# EAGLE design makerbot (EAGLE 8.2.0)
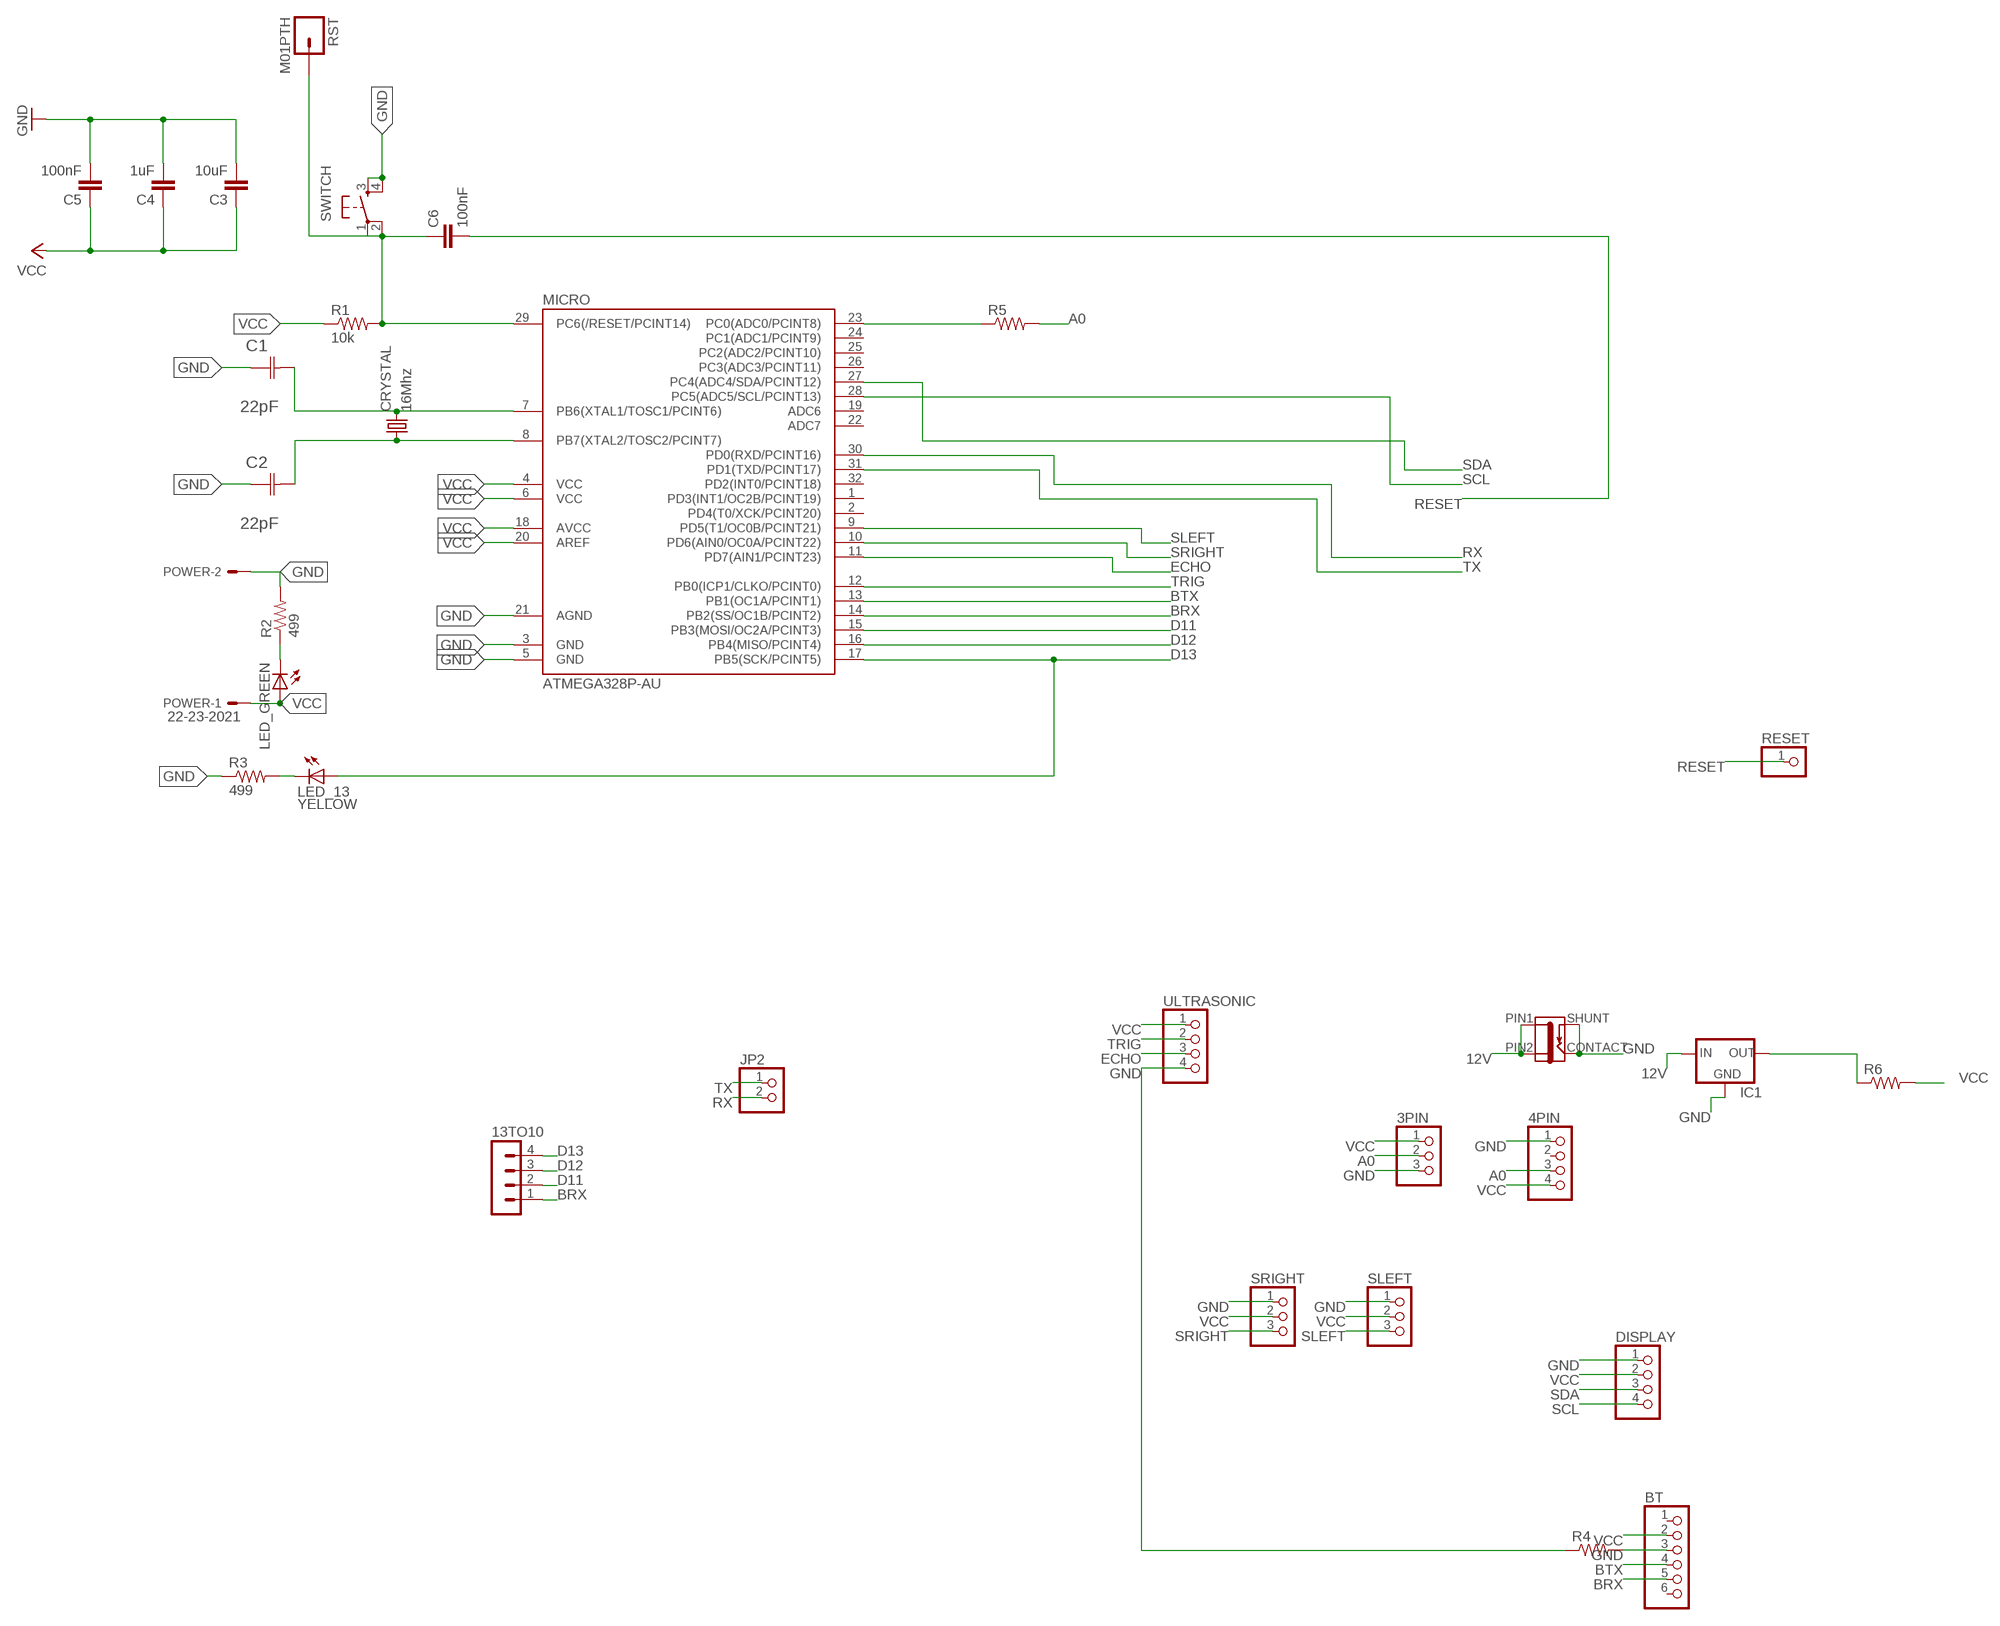
[diagram p0: schematic, sheet 1]

## Parts
3PIN  PINHD-1X3  [1X03]
4PIN  PINHD-1X4  [1X04]
13TO10  MA04-1  [MA04-1]
BT  PINHD-1X6  [1X06]
C1  22pF  0612ZC225MAT2A  [CAPC3216X178N]
C2  22pF  0612ZC225MAT2A  [CAPC3216X178N]
C3  10uF  CAP1206  [1206]
C4  1uF  CAP1206  [1206]
C5  100nF  CAP1206  [1206]
C6  100nF  CAP1206  [1206]
CRYSTAL  16Mhz  CSM-7X-DU  [CSM-7X-DU]
DISPLAY  PINHD-1X4  [1X04]
IC1  78XXL  [78XXL]
J1  JACK-2.1MM  [PJ-002AH-SMT]
JP2  PINHD-1X2  [1X02]
LED_13  YELLOW  LED1206  [1206]
LED_GREEN  LED1206  [1206]
MICRO  ATMEGA328P-AU  ATMEGA48/88/168-AU  [TQFP32-08]
POWER  22-23-2021  [22-23-2021]
R1  10k  RESISTOR1206  [1206]
R2  499  RESISTOR1206  [1206]
R3  499  RESISTOR1206  [1206]
R4  RES-US1206FAB  [R1206FAB]
R5  RES-US1206FAB  [R1206FAB]
R6  RES-US1206FAB  [R1206FAB]
RESET  PINHD-1X1  [1X01]
RST  M01PTH  [1X01]
SLEFT  PINHD-1X3  [1X03]
SRIGHT  PINHD-1X3  [1X03]
SWITCH  6MM_SWITCH6MM_SWITCH  [6MM_SWITCH]
ULTRASONIC  PINHD-1X4  [1X04]

## Nets
12V: IC1.IN J1.PIN1 J1.PIN2
A0: 3PIN.2 4PIN.3 MICRO.23(PC0(ADC0/PCINT8)) R5.1 R5.2
BRX: 13TO10.1 BT.5 MICRO.14(PB2(SS/OC1B/PCINT2))
BTX: BT.4 MICRO.13(PB1(OC1A/PCINT1))
D11: 13TO10.2 MICRO.15(PB3(MOSI/OC2A/PCINT3))
D12: 13TO10.3 MICRO.16(PB4(MISO/PCINT4))
D13: 13TO10.4 LED_13.1(A) MICRO.17(PB5(SCK/PCINT5))
ECHO: MICRO.11(PD7(AIN1/PCINT23)) ULTRASONIC.3
GND: 3PIN.3 4PIN.1 BT.3 C1.1(C1) C2.1(C1) C3.2 C4.2 C5.2 DISPLAY.1 IC1.GND J1.CONTACT J1.SHUNT MICRO.3(GND) MICRO.5(GND) MICRO.21(AGND) POWER.2 R2.2 R3.1 R4.1 R4.2 SLEFT.1 SRIGHT.1 SWITCH.3(S) SWITCH.4(S1) ULTRASONIC.4
N$2: C1.2(C2) CRYSTAL.2 MICRO.7(PB6(XTAL1/TOSC1/PCINT6))
N$9: C2.2(C2) CRYSTAL.1 MICRO.8(PB7(XTAL2/TOSC2/PCINT7))
N$26: LED_GREEN.2(C) R2.1
N$27: LED_13.2(C) R3.2
N$28: C6.1 MICRO.29(PC6(/RESET/PCINT14)) R1.2 RST.1 SWITCH.1(P) SWITCH.2(P1)
RESET: C6.2 RESET.1
RX: JP2.2 MICRO.30(PD0(RXD/PCINT16))
SCL: DISPLAY.4 MICRO.28(PC5(ADC5/SCL/PCINT13))
SDA: DISPLAY.3 MICRO.27(PC4(ADC4/SDA/PCINT12))
SLEFT: MICRO.9(PD5(T1/OC0B/PCINT21)) SLEFT.3
SRIGHT: MICRO.10(PD6(AIN0/OC0A/PCINT22)) SRIGHT.3
TRIG: MICRO.12(PB0(ICP1/CLKO/PCINT0)) ULTRASONIC.2
TX: JP2.1 MICRO.31(PD1(TXD/PCINT17))
VCC: 3PIN.1 4PIN.4 BT.2 C3.1 C4.1 C5.1 DISPLAY.2 IC1.OUT LED_GREEN.1(A) MICRO.4(VCC) MICRO.6(VCC) MICRO.18(AVCC) MICRO.20(AREF) POWER.1 R1.1 R6.1 R6.2 SLEFT.2 SRIGHT.2 ULTRASONIC.1
Unconnected: 4PIN.2 BT.1 BT.6 MICRO.1(PD3(INT1/OC2B/PCINT19)) MICRO.2(PD4(T0/XCK/PCINT20)) MICRO.19(ADC6) MICRO.22(ADC7) MICRO.24(PC1(ADC1/PCINT9)) MICRO.25(PC2(ADC2/PCINT10)) MICRO.26(PC3(ADC3/PCINT11)) MICRO.32(PD2(INT0/PCINT18))

## Library data of the parts
3PIN SLEFT SRIGHT = pinhead:PINHD-1X3: PIN HEADER
4PIN DISPLAY ULTRASONIC = pinhead:PINHD-1X4: PIN HEADER
13TO10 = con-lstb:MA04-1: PIN HEADER; OC_FARNELL: unknown; OC_NEWARK: unknown
BT = pinhead:PINHD-1X6: PIN HEADER
C1 C2 = AVX_By_element14_Batch_1:0612ZC225MAT2A: Capacitor 1206; MPN: 0612ZC225MAT2A; OC_FARNELL: -; OC_NEWARK: 12N3209; SUPPLIER: AVX; TOLERANCE: ±20%; VALUE: 2.2µF; VOLTAGERATING: 10V
C3-C6 = 01_SparkFun:CAP: Capacitor Standard 0603 ceramic capacitor, and 0.1" leaded capacitor.
CRYSTAL = 01_FAB_Hello:CSM-7X-DU: SMD CRYSTAL Source: www.ecsxtal.com .. Crystal 3.6864MHz CSM_7X_DU.PDF; OC_FARNELL: unknown; OC_NEWARK: unknown
IC1 = v-reg:78XXL: VOLTAGE REGULATOR
J1 = fab:JACK-2.1MM: SMD DC power jack PJ-002AH-SMT As found in the fablab inventory. Made by Zaerc.
JP2 = pinhead:PINHD-1X2: PIN HEADER
LED_13 LED_GREEN = 01_FAB_Hello:LED
MICRO = atmega8:ATMEGA48/88/168
POWER = con-molex:22-23-2021: .100" (2.54mm) Center Header - 2 Pin; MF: MOLEX; MPN: 22-23-2021; OC_FARNELL: 1462926; OC_NEWARK: 25C3832
R1-R3 = 01_SparkFun:RESISTOR: Resistor Basic schematic elements and footprints for 0603, 1206, and PTH 1/10th watt (small) resistors.
R4-R6 = fab:RES-US: Resistor (US Symbol) Variants with postfix FAB are widened to allow the routing of internal traces
RESET = pinhead:PINHD-1X1: PIN HEADER
RST = 01_SparkFun:M01: Header 1 Standard 1-pin 0.1" header. Use with straight break away headers (SKU : PRT-00116), right angle break away headers (PRT-00553), swiss pins (PRT-00743), machine pins (PRT-00117), and female headers (PRT-00115).
SWITCH = 01_FAB_Hello:6MM_SWITCH: OMRON SWITCH

## Net classes
0 default: width 0.1 mm, clearance 0.5 mm

## Board
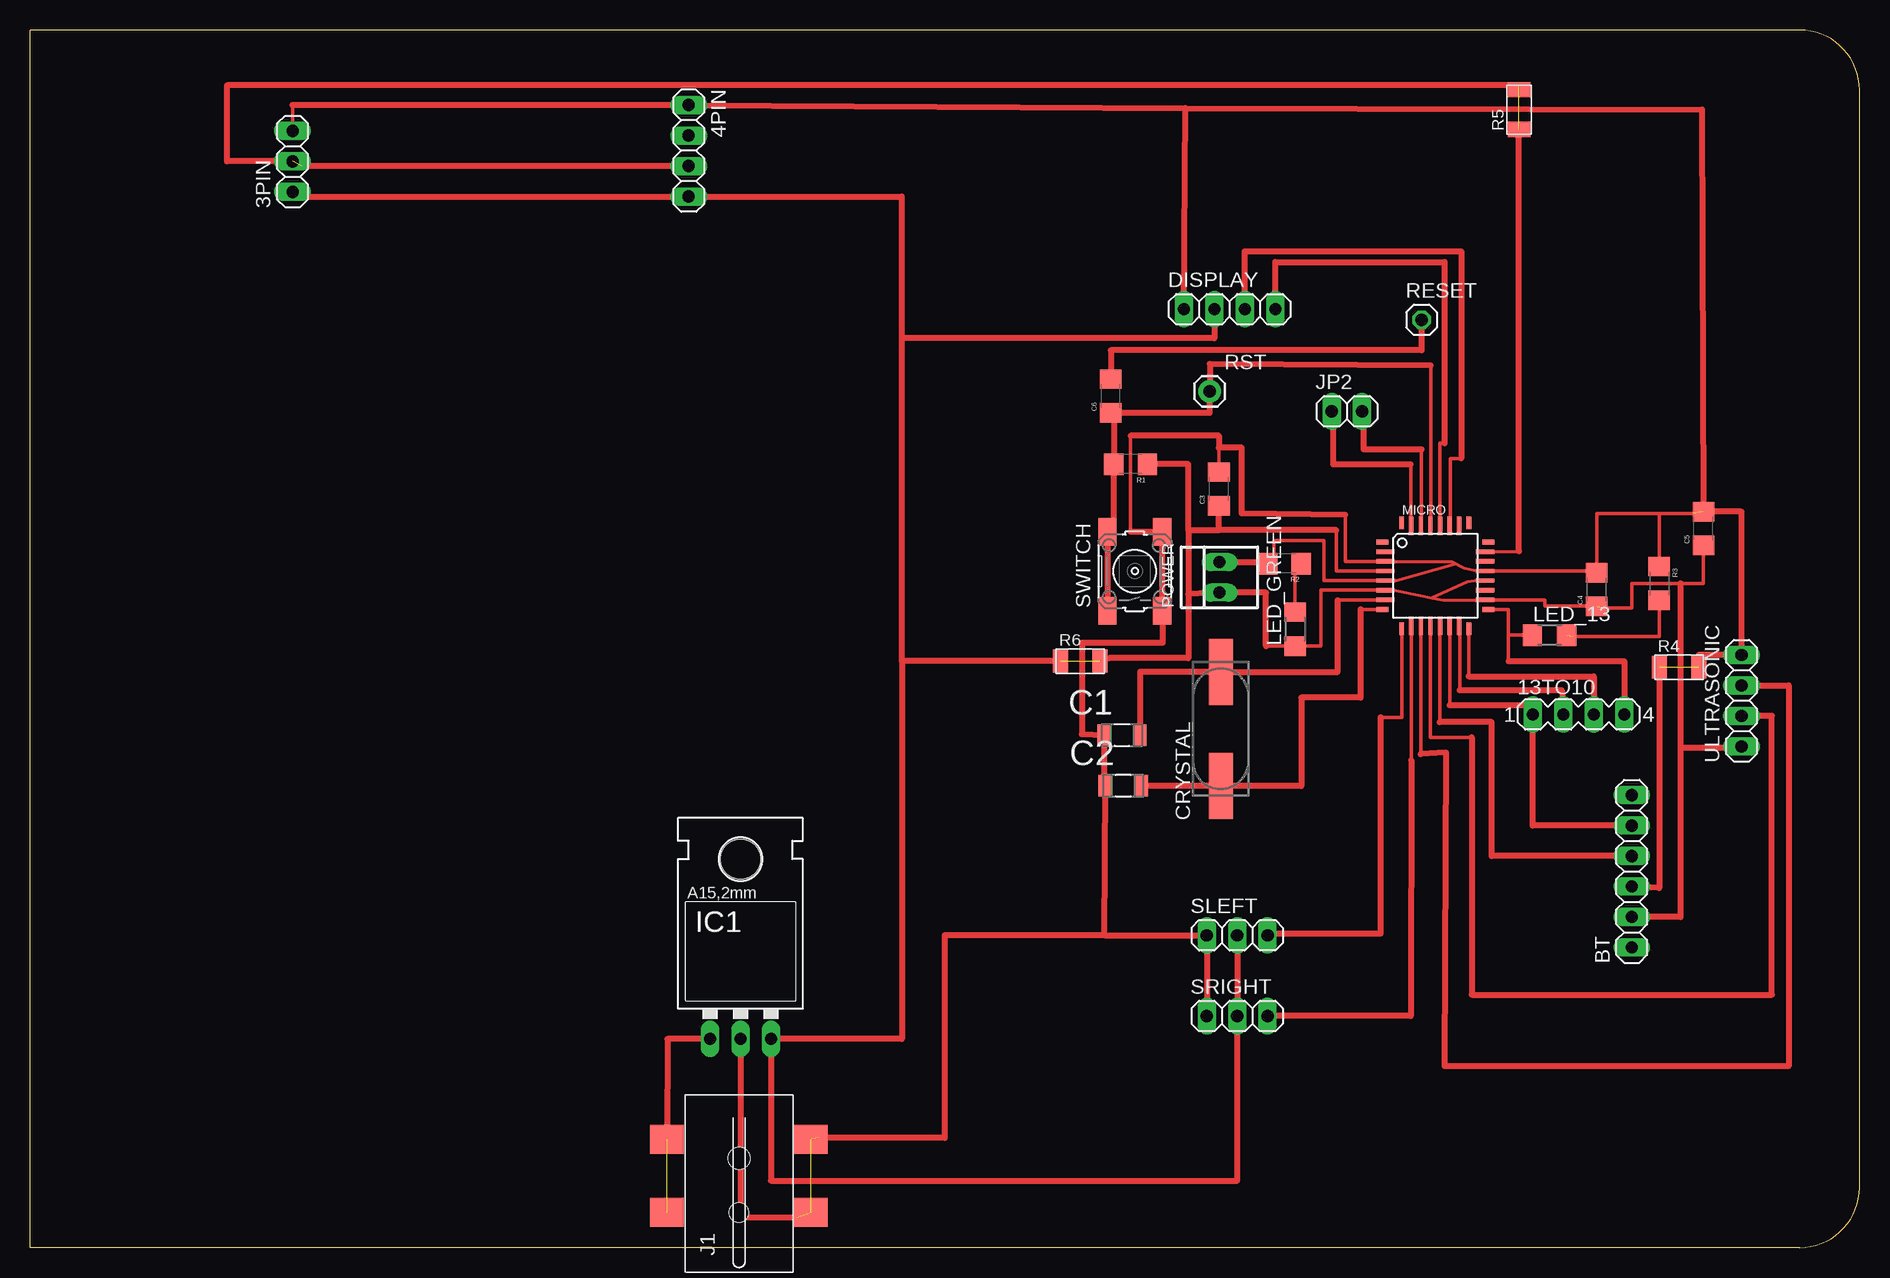
[diagram p1: board, top side]

Size 152.5 x 101.5 mm. Coordinates in mm from the lower left corner, seen from the top.
Outline: 0,0 0,101.5 147.5,101.5 arc-90 152.5,96.5 152.5,5 arc-90 147.5,0 0,0
Copper layers (1*16): Top 0.035mm / dielectric 1.5mm / Bottom 0.035mm
Design rules "fabmodule": minimum track width 10mil, minimum drill 0.4mm, track to track 0.42mm, track to pad 0.42mm, pad to pad 0.42mm, via to via 0.42mm, smd to smd 0.42mm, copper to edge 40mil, drill to drill 0.8mm, minimum pad ring 10mil, minimum via ring 8mil, stop-mask expansion 4mil, vias tented up to drill 0mil, thermal gap 10mil

### Footprints (pad centres in the part's own frame; a part is rotated, then mirrored left to right if it is on the bottom)
1X03 = drill 1.016 long: 1 -2.54,0; 2 0,0; 3 2.54,0
1X04 = drill 1.016 long: 1 -3.81,0; 2 -1.27,0; 3 1.27,0; 4 3.81,0
MA04-1 = drill 1.016 long: 1 -3.81,0; 2 -1.27,0; 3 1.27,0; 4 3.81,0
1X06 = drill 1.016 long: 1 -6.35,0; 2 -3.81,0; 3 -1.27,0; 4 1.27,0; 5 3.81,0; 6 6.35,0
CAPC3216X178N = smd 1.118 x 1.803: 1 -1.499,0; 2 1.499,0
1206 = smd 1.6 x 1.8: 1 -1.4,0; 2 1.4,0
CSM-7X-DU = smd 5.5 x 2: 1 -4.75,0; 2 4.75,0
78XXL = drill 1.016 long: GND 0,-3.81; IN -2.54,-3.81; OUT 2.54,-3.81 | hole 3.302: 0,11.176
PJ-002AH-SMT = smd 2.4 x 2.8: CONTACT -2.4,-6; PIN1 3.7,6; PIN2 -2.4,6; SHUNT 3.7,-6 | hole 1.6: -2.4,0 | hole 1.8: 2.1,0
1X02 = drill 1.016 long: 1 -1.27,0; 2 1.27,0
1206' = smd 1.6 x 1.803: 1 -1.422,0; 2 1.422,0
TQFP32-08 = smd 1.016 x 0.406: 1 -4.42,2.8; 8 -4.42,-2.8; 17 4.42,-2.8; 24 4.42,2.8 | smd 1.524 x 0.356: 2 -4.166,2; 3 -4.166,1.2; 4 -4.166,0.4; 5 -4.166,-0.4; 6 -4.166,-1.2; 7 -4.166,-2; 18 4.166,-2; 19 4.166,-1.2; 20 4.166,-0.4; 21 4.166,0.4; 22 4.166,1.2; 23 4.166,2 | smd 0.406 x 1.016: 9 -2.8,-4.42; 16 2.8,-4.42; 25 2.8,4.42; 32 -2.8,4.42 | smd 0.356 x 1.524: 10 -2,-4.166; 11 -1.2,-4.166; 12 -0.4,-4.166; 13 0.4,-4.166; 14 1.2,-4.166; 15 2,-4.166; 26 2,4.166; 27 1.2,4.166; 28 0.4,4.166; 29 -0.4,4.166; 30 -1.2,4.166; 31 -2,4.166
22-23-2021 = drill 1 long: 1 -1.27,0; 2 1.27,0
R1206FAB = smd 1.27 x 1.905: 1 -1.651,0; 2 1.651,0
1X01 = drill 1.016 octagon: 1 0,0
1X01' = drill 1.016 pad 1.88: 1 0,0
6MM_SWITCH = smd 2.286 x 1.524: 1 -3.302,2.286; 2 3.302,2.286; 3 -3.302,-2.286; 4 3.302,-2.286

### Placement (x,y rotation side)
3PIN  21.89,90.54 90 top
4PIN  54.91,91.43 270 top
13TO10  129.07,44.44 0 top
BT  133.52,31.36 90 top
C1  91.02,42.72 0 top
C2  91.13,38.5 0 top
C3  99.1,63.24 90 top
C4  130.6,54.86 90 top
C5  139.49,59.94 90 top
C6  90.08,70.99 90 top
CRYSTAL  99.25,43.25 90 top
DISPLAY  99.99,78.23 0 top
IC1  59.22,21.2 0 top
J1  59.1,5.33 90 top
JP2  109.77,69.72 0 top
LED_13  YELLOW  [1206']  126.66,51.05 0 top
LED_GREEN  [1206']  105.45,51.56 90 top
MICRO  117.14,56 0 top
POWER  99.15,55.87 90 top
R1  91.74,65.3 180 top
R2  104.56,57.02 180 top
R3  135.8,55.37 270 top
R4  137.46,48.38 0 top
R5  124.12,94.86 90 top
R6  87.54,48.89 0 top
RESET  115.99,77.34 0 top
RST  M01PTH  [1X01']  98.34,71.37 0 top
SLEFT  100.63,26.03 0 top
SRIGHT  100.63,19.3 0 top
SWITCH  92.09,56.38 90 top
ULTRASONIC  142.66,45.59 90 top

### Tracks (layer width: path | path; a pad name or v marks a point on that pad's centre or on a via)
12V  (1 unrouted)
  Top 0.508: IC1.IN 53.13,17.39 J1.PIN1
A0  (3 unrouted)
  Top 0.305: MICRO.23 124.12,58.03
  Top 0.508: 4PIN.3 22.65,90.16 | 3PIN.2 16.42,90.54 16.42,96.89 124.12,96.89 | 124.12,58.03 R5.1
BRX
  Top 0.305: 118.34,45.21 MICRO.14
  Top 0.508: 118.34,45.21 125.26,45.21 13TO10.1 125.26,35.17 BT.5
BTX
  Top 0.305: MICRO.13 117.52,43.81
  Top 0.508: 117.52,43.81 121.83,43.81 121.83,32.63 BT.4
D11
  Top 0.305: 119.17,46.48 119.17,51.05 MICRO.15
  Top 0.508: 119.17,46.48 127.68,46.48 13TO10.2
D12
  Top 0.305: MICRO.16 119.94,47.62
  Top 0.508: 119.94,47.62 130.34,47.62 13TO10.3
D13
  Top 0.305: 123.23,51.05 123.23,48.89 | LED_13.1 123.23,51.05 | MICRO.17 123.23,53.2 123.23,51.05
  Top 0.508: 123.23,48.89 132.88,48.89 13TO10.4
ECHO
  Top 0.305: 115.94,41.14 MICRO.11
  Top 0.508: 115.94,41.14 118.02,41.27 117.9,15.11 146.6,15.11 146.6,46.86 ULTRASONIC.3
GND  (5 unrouted)
  Top 0.254: MICRO.3 113,57.17 118.52,57.17 | 118.52,57.17 119.55,56.64 120.69,56.38 | 113.58,55.62 113.83,55.62 118.71,56.97 | 118.71,56.97 118.85,57 | 118.52,57.17 118.71,56.97
  Top 0.305: MICRO.5 | MICRO.21 | C2.1 89.53,38.63 | MICRO.5 112.97,55.62 107.86,55.62 107.86,58.92 103.67,58.92 103.67,56.89 R2.2 103.16,57.14 | MICRO.21 130.6,56.4 C4.2 130.6,61.21 135.8,61.21 | 113.58,55.62 MICRO.5 | MICRO.21 120.69,56.38 | MICRO.3 109.64,57.2 109.64,61.08 | C3.2 99.1,66.67 | SWITCH.3 94.4,53.08 | 94.4,59.68 SWITCH.4 94.38,59.05 94.4,59.05 | 135.8,61.21 138.6,61.21 | R3.1 135.8,61.21 | 139.11,49.4 R4.2 | 96.31,94.99 | 21.89,95.24 3PIN.3 | 91.74,67.68 91.74,59.68
  Top 0.508: 89.53,38.63 C1.1 87.67,42.79 87.67,50.41 94.4,50.41 94.4,53.08 94.4,59.05 | POWER.2 103.16,57.14 | 109.64,61.08 101.01,61.21 101.01,66.67 99.1,66.67 99.1,67.68 91.74,67.68 | 139.11,49.4 ULTRASONIC.4 142.66,61.33 C5.2 139.37,94.86 96.31,94.99 4PIN.1 21.89,95.24 | R4.1 135.8,29.97 BT.3 | DISPLAY.1 96.31,94.99 | 89.58,26.03 SLEFT.1 SRIGHT.1 | 89.58,26.03 C2.1 | IC1.GND 59.22,2.53 63.92,2.53 | 91.74,59.68 SWITCH.4 | 89.58,26.03 76.24,26.03 76.25,9.13 65.7,9.14
N$2
  Top 0.305: 92.52,48 C1.2 | 109.01,53.97 112.97,53.97 MICRO.7
  Top 0.508: 109.01,53.97 109.01,48 CRYSTAL.2 92.52,48 C1.2
N$9
  Top 0.305: 92.62,38.47 C2.2 | MICRO.8 112.72,53.21 110.91,53.21 | C2.2 | 99.25,38.47 CRYSTAL.1
  Top 0.508: CRYSTAL.1 C2.2 | 110.91,53.21 110.91,45.84 105.96,45.84 105.96,38.47 99.25,38.47
N$26
  Top 0.305: 106.34,56.76 R2.1 105.96,56.64 105.45,56.64 LED_GREEN.2
N$27  (1 unrouted)
  Top 0.305: R3.2 135.8,50.92 128.69,50.92
N$28
  Top 0.305: MICRO.29 116.75,60.17 116.75,73.53 | R1.2 90.08,65.3 | SWITCH.2 90.34,59.68 | C6.1 90.34,69.59
  Top 0.508: 90.34,59.68 R1.2 90.34,69.59 98.34,69.59 RST.1 98.34,73.65 116.75,73.53 | SWITCH.2 SWITCH.1
RESET
  Top 0.508: C6.2 90.08,74.8 115.99,74.8 RESET.1
RX
  Top 0.305: MICRO.30 115.99,60.17 115.99,66.54 | 111.17,68.83 JP2.2
  Top 0.508: 115.99,66.54 111.17,66.54 111.17,68.83
SCL
  Top 0.305: MICRO.28 117.52,60.17 117.52,67.05 117.9,67.05
  Top 0.508: DISPLAY.4 103.8,82.16 117.9,82.16 117.9,67.05
SDA
  Top 0.305: MICRO.27 118.41,60.17 118.41,65.78 119.29,65.78
  Top 0.508: DISPLAY.3 101.26,83.05 119.29,83.05 119.29,65.78
SLEFT
  Top 0.305: 112.56,44.19 114.34,44.19 MICRO.9
  Top 0.508: 112.56,44.19 112.56,26.16 103.8,26.16 SLEFT.3
SRIGHT
  Top 0.305: MICRO.10 115.14,40.63
  Top 0.508: 115.14,40.63 115.1,19.3 SRIGHT.3
TRIG
  Top 0.305: 116.75,51.83 MICRO.12 116.74,42.54 120.18,42.54
  Top 0.508: 120.18,42.54 120.18,21.07 145.2,21.07 145.2,44.32 ULTRASONIC.2
TX
  Top 0.305: MICRO.31 115.1,60.17 115.1,65.27 | 108.63,68.7 JP2.1
  Top 0.508: 115.1,65.27 108.63,65.27 108.63,68.7
VCC  (2 unrouted)
  Top 0.254: 113.66,54.81 116.11,54.31 116.87,54.15 | 116.87,54.15 117.77,53.97 121.3,53.97 | MICRO.20 120.69,55.6 120.69,55.62 119.8,55.49 116.87,54.15
  Top 0.305: MICRO.18 | MICRO.20 120.69,55.62 | MICRO.4 108.88,56.4 108.88,59.81 | 121.3,53.97 MICRO.18 | 103.04,50.13 LED_GREEN.1 105.45,50.16 107.61,50.16 107.61,54.8 MICRO.6 113.66,54.81 | MICRO.18 126.28,54 126.28,53.46 C4.1 | C3.1 99.48,61.84 99.48,61.59 | C5.1 139.49,55.37 137.58,55.37 133.52,55.37 133.52,53.33 131.49,53.33 | 142.15,41.65 ULTRASONIC.1 | 22.52,87.62 3PIN.1 | 89.96,49.14 R6.2
  Top 0.508: 108.88,59.81 99.1,59.81 | 96.56,59.81 96.56,65.3 R1.1 | 96.56,59.81 96.56,54.48 | 96.56,54.48 POWER.1 103.04,54.6 103.04,50.13 | 96.56,59.81 99.1,59.81 | 99.1,59.81 C3.1 | 142.15,41.65 137.58,41.65 | 137.58,55.37 137.58,41.65 | 137.58,41.65 137.58,27.55 BT.2 | 22.52,87.62 4PIN.4 72.69,87.62 72.69,75.81 | 72.69,48.89 72.69,75.81 | 72.69,48.89 72.69,17.39 IC1.OUT 61.76,5.58 100.63,5.58 SRIGHT.2 SLEFT.2 | DISPLAY.2 98.72,75.81 72.69,75.81 | 96.56,54.48 96.56,49.14 89.96,49.14 | R6.1 72.69,48.89